# Altium schematic sheet LPC_Rep.SchDoc
size A4; Organization: UNSW Solar Racing Team; Address3: UNSW; Address4: Sydney NSW 2052; Address2: Electrical Engineering; Address1: Rm 109
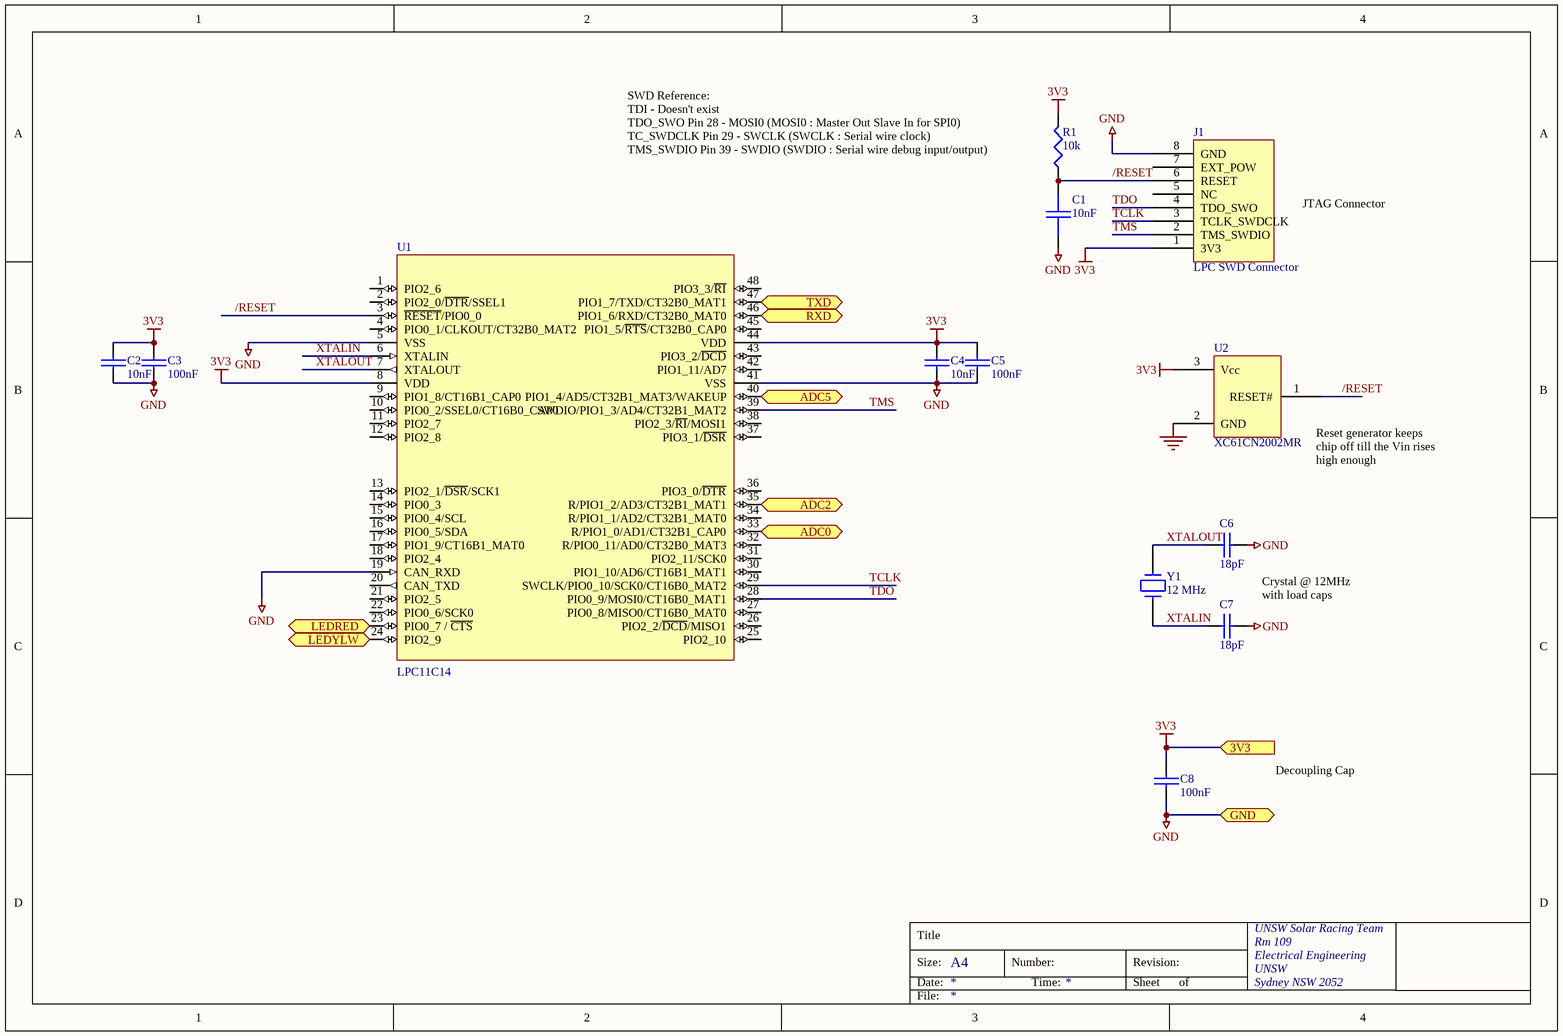
[diagram p0: LPC_Rep.SchDoc]

## Parts
C1  10nF  [0603]
C2  10nF  [0603]
C3  100nF  [0603]
C4  10nF  [0603]
C5  100nF  [0603]
C6  18pF  [0603]
C7  18pF  [0603]
C8  100nF  [0603]
J1  LPC SWD Connector  [IDC8]
R1  10k  [0603]
U1  LPC11C14  [TSQFP50P900X900-48N]
U2  XC61CN2002MR  [SOT23-3]
Y1  12 MHz  [HC49/4H]

## Ports
3V3, ADC0, ADC2, ADC5, GND, LEDRED (bidir), LEDYLW (bidir), RXD (bidir), TXD (bidir)

## Nets
3V3: C2.2 C3.2 C4.2 C5.2 C8.1 J1.1(3V3) R1.2 U1.8(VDD) U1.44(VDD) U2.3(Vcc) ; port 3V3
GND: C1.2 C2.1 C3.1 C4.1 C5.1 C6.2 C7.2 C8.2 J1.8(GND) U1.5(VSS) U1.19(CAN_RXD) U1.41(VSS) U2.2(GND) ; port GND
/RESET: C1.1 J1.6(RESET) R1.1 U1.3(~{RESET}/PIO0_0) U2.1(RESET#)
ADC0: U1.33(R/PIO1_0/AD1/CT32B1_CAP0) ; port ADC0
ADC2: U1.35(R/PIO1_2/AD3/CT32B1_MAT1) ; port ADC2
ADC5: U1.40(PIO1_4/AD5/CT32B1_MAT3/WAKEUP) ; port ADC5
LEDRED: U1.23(PIO0_7_/_~{CTS}) ; port LEDRED
LEDYLW: U1.24(PIO2_9) ; port LEDYLW
RXD: U1.46(PIO1_6/RXD/CT32B0_MAT0) ; port RXD
TCLK: J1.3(TCLK_SWDCLK) U1.29(SWCLK/PIO0_10/SCK0/CT16B0_MAT2)
TDO: J1.4(TDO_SWO) U1.28(PIO0_9/MOSI0/CT16B0_MAT1)
TMS: J1.2(TMS_SWDIO) U1.39(SWDIO/PIO1_3/AD4/CT32B1_MAT2)
TXD: U1.47(PIO1_7/TXD/CT32B0_MAT1) ; port TXD
XTALIN: C7.1 U1.6(XTALIN) Y1.1
XTALOUT: C6.1 U1.7(XTALOUT) Y1.2

Not connected (* = marked no-connect by the designer): J1 5(NC) 7(EXT_POW); U1 1(PIO2_6) 2(PIO2_0/~{DTR}/SSEL1) 4(PIO0_1/CLKOUT/CT32B0_MAT2) 9(PIO1_8/CT16B1_CAP0) 10(PIO0_2/SSEL0/CT16B0_CAP0) 11(PIO2_7) 12(PIO2_8) 13(PIO2_1/~{DSR}/SCK1) 14(PIO0_3) 15(PIO0_4/SCL) 16(PIO0_5/SDA) 17(PIO1_9/CT16B1_MAT0) 18(PIO2_4) 20(CAN_TXD) 21(PIO2_5) 22(PIO0_6/SCK0) 25(PIO2_10) 26(PIO2_2/~{DCD}/MISO1) 27(PIO0_8/MISO0/CT16B0_MAT0) 30(PIO1_10/AD6/CT16B1_MAT1) 31(PIO2_11/SCK0) 32(R/PIO0_11/AD0/CT32B0_MAT3) 34(R/PIO1_1/AD2/CT32B1_MAT0) 36(PIO3_0/~{DTR}) 37(PIO3_1/~{DSR}) 38(PIO2_3/~{RI}/MOSI1) 42(PIO1_11/AD7) 43(PIO3_2/~{DCD}) 45(PIO1_5/~{RTS}/CT32B0_CAP0) 48(PIO3_3/~{RI})

## Notes on the sheet
- SWD Reference:
  TDI - Doesn't exist
  TDO_SWO Pin 28 - MOSI0 (MOSI0 : Master Out Slave In for SPI0)
  TC_SWDCLK Pin 29 - SWCLK (SWCLK : Serial wire clock)
  TMS_SWDIO Pin 39 - SWDIO (SWDIO : Serial wire debug input/output)
- JTAG Connector
- (near U2) Reset generator keeps chip off till the Vin rises high enough
- Crystal @ 12MHz with load caps
- Decoupling Cap
- Title
- Size:
- Date:
- A4
- Number:
- Time:
- Revision:
- Sheet
- of
- File:

## Library data of the parts
C1-C8 = CAP: Capacitor
  C1: Farnell: 722-236; Price: 0.15
  C2-C5 C8: Farnell: 753-567; Price: 0.31
  C6 C7: Farnell: 721-992; Price: 0.11
J1 = LPCLink_Connector: Farnell: 511-808; Price: 1.32
R1 = RES1: Resistor; Farnell: 612-601; Price: 0.11
U1 = LPC11C14_Full: Farnell: NA
U2 = XC61F: SOT23 reset generator; Farnell: NA
Y1 = CRYSTAL: Farnell: 485-111; Price: 3.38